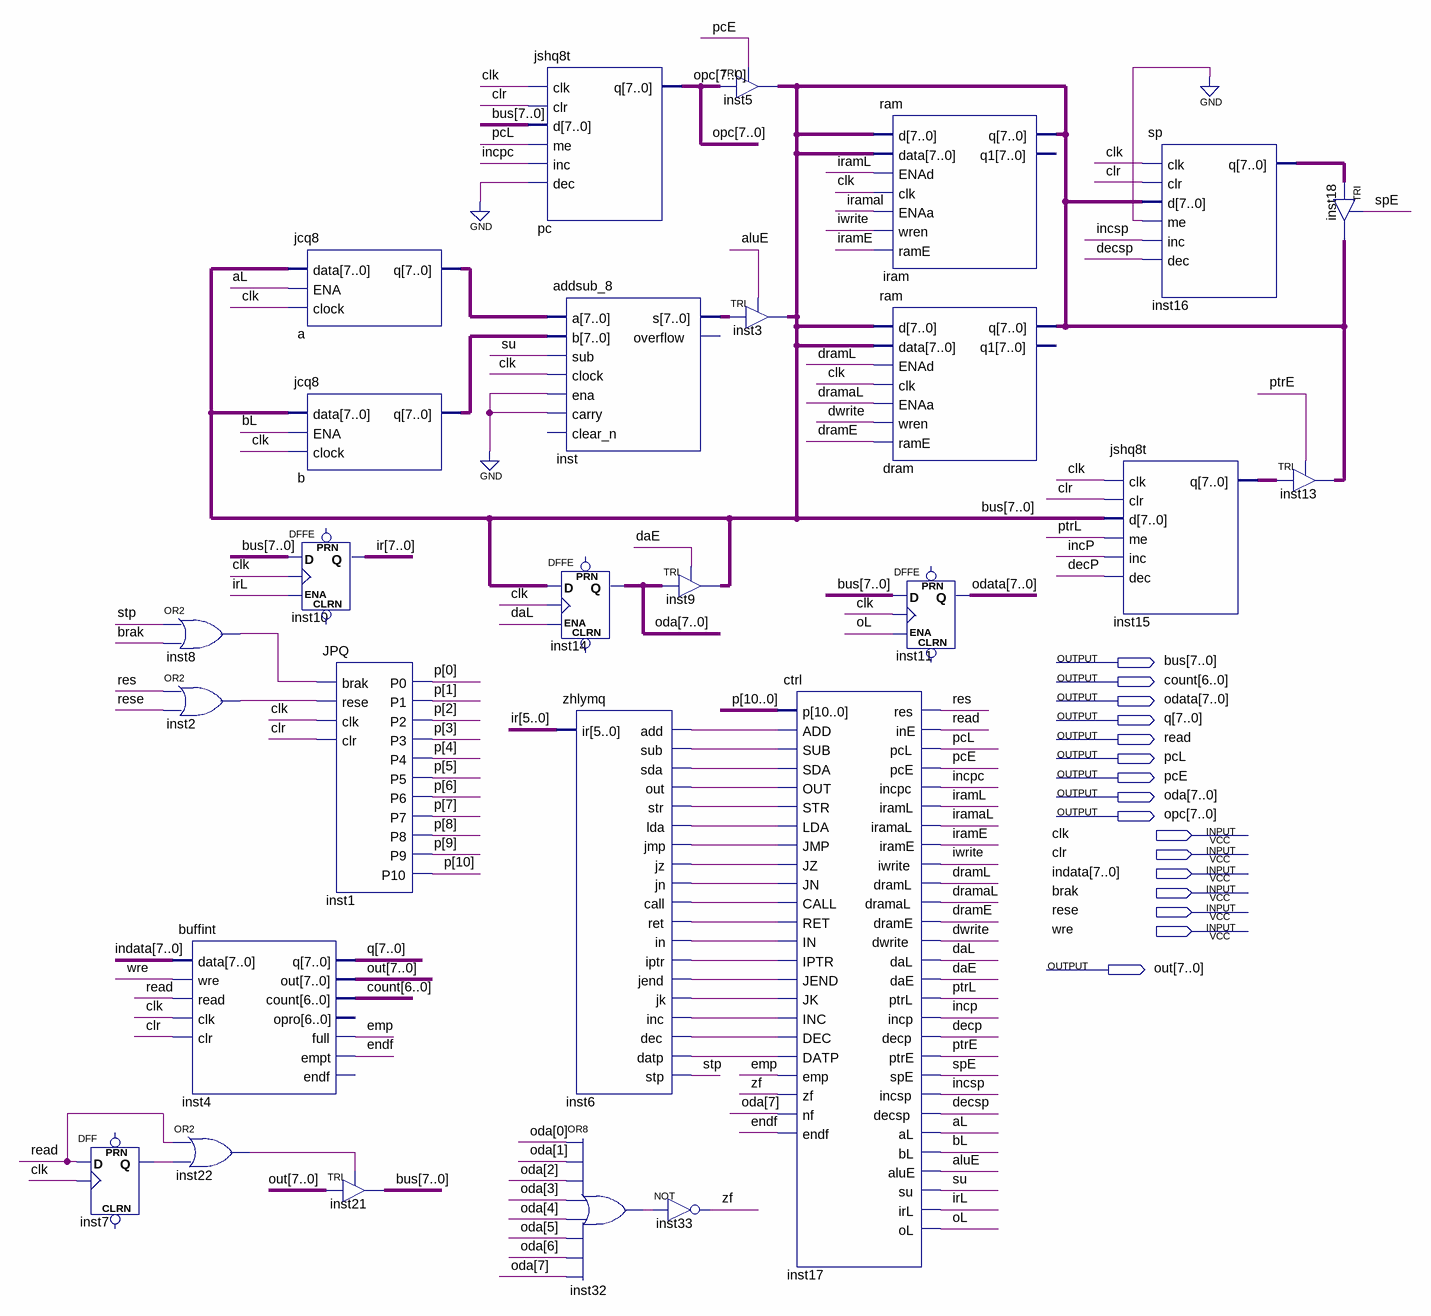
[diagram p0: schematic sheet]
// Quartus schematic buffcpu.bdf as structural Verilog: 27 symbols, 16 pins
module buffcpu (
  input  clk,
  input  clr,
  input  [7:0] indata,
  input  brak,
  input  rese,
  input  wre,
  output [7:0] bus,
  output [6:0] count,
  output [7:0] odata,
  output [7:0] q,
  output read,
  output pcL,
  output pcE,
  output [7:0] oda,
  output [7:0] opc,
  output [7:0] out
);

  wire aL, aluE, bL, daE, daL, decp, decsp, dramaL, dramE, dramL, dwrite, emp, endf, incp, incpc, incsp,
       inst2_out, inst6_add, inst6_call, inst6_datp, inst6_dec, inst6_in, inst6_inc, inst6_iptr, inst6_jend,
       inst6_jk, inst6_jmp, inst6_jn, inst6_jz, inst6_lda, inst6_out, inst6_ret, inst6_sda, inst6_str,
       inst6_sub, inst7_q, inst8_out, inst22_out, inst32_out, iramaL, iramE, iramL, irL, iwrite, oL, ptrE,
       ptrL, res, spE, stp, su, zf;
  wire [7:0] a_q, b_q, inst15_q, inst16_q, inst_s, ir;
  wire [10:0] p;

  DFF inst7 (.CLK(clk), .D(read), .Q(inst7_q));  // open: CLRN, PRN
  or inst8 (inst8_out, stp, brak);
  or inst2 (inst2_out, res, rese);
  buffint inst4 (
    .data(indata), .wre(wre), .read(read), .clk(clk), .clr(clr), .q(q), .out(out), .count(count), .full(emp),
    .empt(endf));  // open: opro, endf
  or inst22 (inst22_out, read, inst7_q);
  jcq8 a (.data(bus), .ENA(aL), .clock(clk), .q(a_q));
  jcq8 b (.data(bus), .ENA(bL), .clock(clk), .q(b_q));
  DFFE inst10[7:0] (.D(bus), .CLK(clk), .ENA(irL), .Q(ir));  // open: PRN, CLRN
  JPQ inst1 (
    .brak(inst8_out), .rese(inst2_out), .clk(clk), .clr(clr), .P0(p[0]), .P1(p[1]), .P2(p[2]), .P3(p[3]),
    .P4(p[4]), .P5(p[5]), .P6(p[6]), .P7(p[7]), .P8(p[8]), .P9(p[9]), .P10(p[10]));
  TRI inst21[7:0] (.IN(out), .OE(inst22_out), .OUT(bus));
  jshq8t pc (.clk(clk), .clr(clr), .d(bus), .me(pcL), .inc(incpc), .dec(1'b0), .q(opc));
  addsub_8 inst (
    .a(a_q), .b(b_q), .sub(su), .clock(clk), .ena(1'b0), .carry(1'b0), .s(inst_s));  // open: clear_n, overflow
  DFFE inst14[7:0] (.D(bus), .CLK(clk), .ENA(daL), .Q(oda));  // open: PRN, CLRN
  zhlymq inst6 (
    .ir(ir[5:0]), .add(inst6_add), .sub(inst6_sub), .sda(inst6_sda), .out(inst6_out), .str(inst6_str),
    .lda(inst6_lda), .jmp(inst6_jmp), .jz(inst6_jz), .jn(inst6_jn), .call(inst6_call), .ret(inst6_ret),
    .in(inst6_in), .iptr(inst6_iptr), .jend(inst6_jend), .jk(inst6_jk), .inc(inst6_inc), .dec(inst6_dec),
    .datp(inst6_datp), .stp(stp));
  or inst32 (inst32_out, oda[0], oda[1], oda[2], oda[3], oda[4], oda[5], oda[6], oda[7]);
  TRI inst9[7:0] (.IN(oda), .OE(daE), .OUT(bus));
  not inst33 (zf, inst32_out);
  TRI inst5[7:0] (.IN(opc), .OE(pcE), .OUT(bus));
  TRI inst3[7:0] (.IN(inst_s), .OE(aluE), .OUT(bus));
  ctrl inst17 (
    .p(p), .ADD(inst6_add), .SUB(inst6_sub), .SDA(inst6_sda), .OUT(inst6_out), .STR(inst6_str),
    .LDA(inst6_lda), .JMP(inst6_jmp), .JZ(inst6_jz), .JN(inst6_jn), .CALL(inst6_call), .RET(inst6_ret),
    .IN(inst6_in), .IPTR(inst6_iptr), .JEND(inst6_jend), .JK(inst6_jk), .INC(inst6_inc), .DEC(inst6_dec),
    .DATP(inst6_datp), .emp(emp), .zf(zf), .nf(oda[7]), .endf(endf), .res(res), .inE(read), .pcL(pcL),
    .pcE(pcE), .incpc(incpc), .iramL(iramL), .iramaL(iramaL), .iramE(iramE), .iwrite(iwrite), .dramL(dramL),
    .dramaL(dramaL), .dramE(dramE), .dwrite(dwrite), .daL(daL), .daE(daE), .ptrL(ptrL), .incp(incp),
    .decp(decp), .ptrE(ptrE), .spE(spE), .incsp(incsp), .decsp(decsp), .aL(aL), .bL(bL), .aluE(aluE),
    .su(su), .irL(irL), .oL(oL));
  ram iram (
    .d(bus), .data(bus), .ENAd(iramL), .clk(clk), .ENAa(iramaL), .wren(iwrite), .ramE(iramE), .q(bus));  // open: q1
  ram dram (
    .d(bus), .data(bus), .ENAd(dramL), .clk(clk), .ENAa(dramaL), .wren(dwrite), .ramE(dramE), .q(bus));  // open: q1
  DFFE inst11[7:0] (.D(bus), .CLK(clk), .ENA(oL), .Q(odata));  // open: PRN, CLRN
  sp inst16 (.clk(clk), .clr(clr), .d(bus), .me(1'b0), .inc(incsp), .dec(decsp), .q(inst16_q));
  jshq8t inst15 (.clk(clk), .clr(clr), .d(bus), .me(ptrL), .inc(incp), .dec(decp), .q(inst15_q));
  TRI inst13[7:0] (.IN(inst15_q), .OE(ptrE), .OUT(bus));
  TRI inst18[7:0] (.IN(inst16_q), .OE(spE), .OUT(bus));
endmodule
